# EAGLE design health_companion (EAGLE 9.4.0)
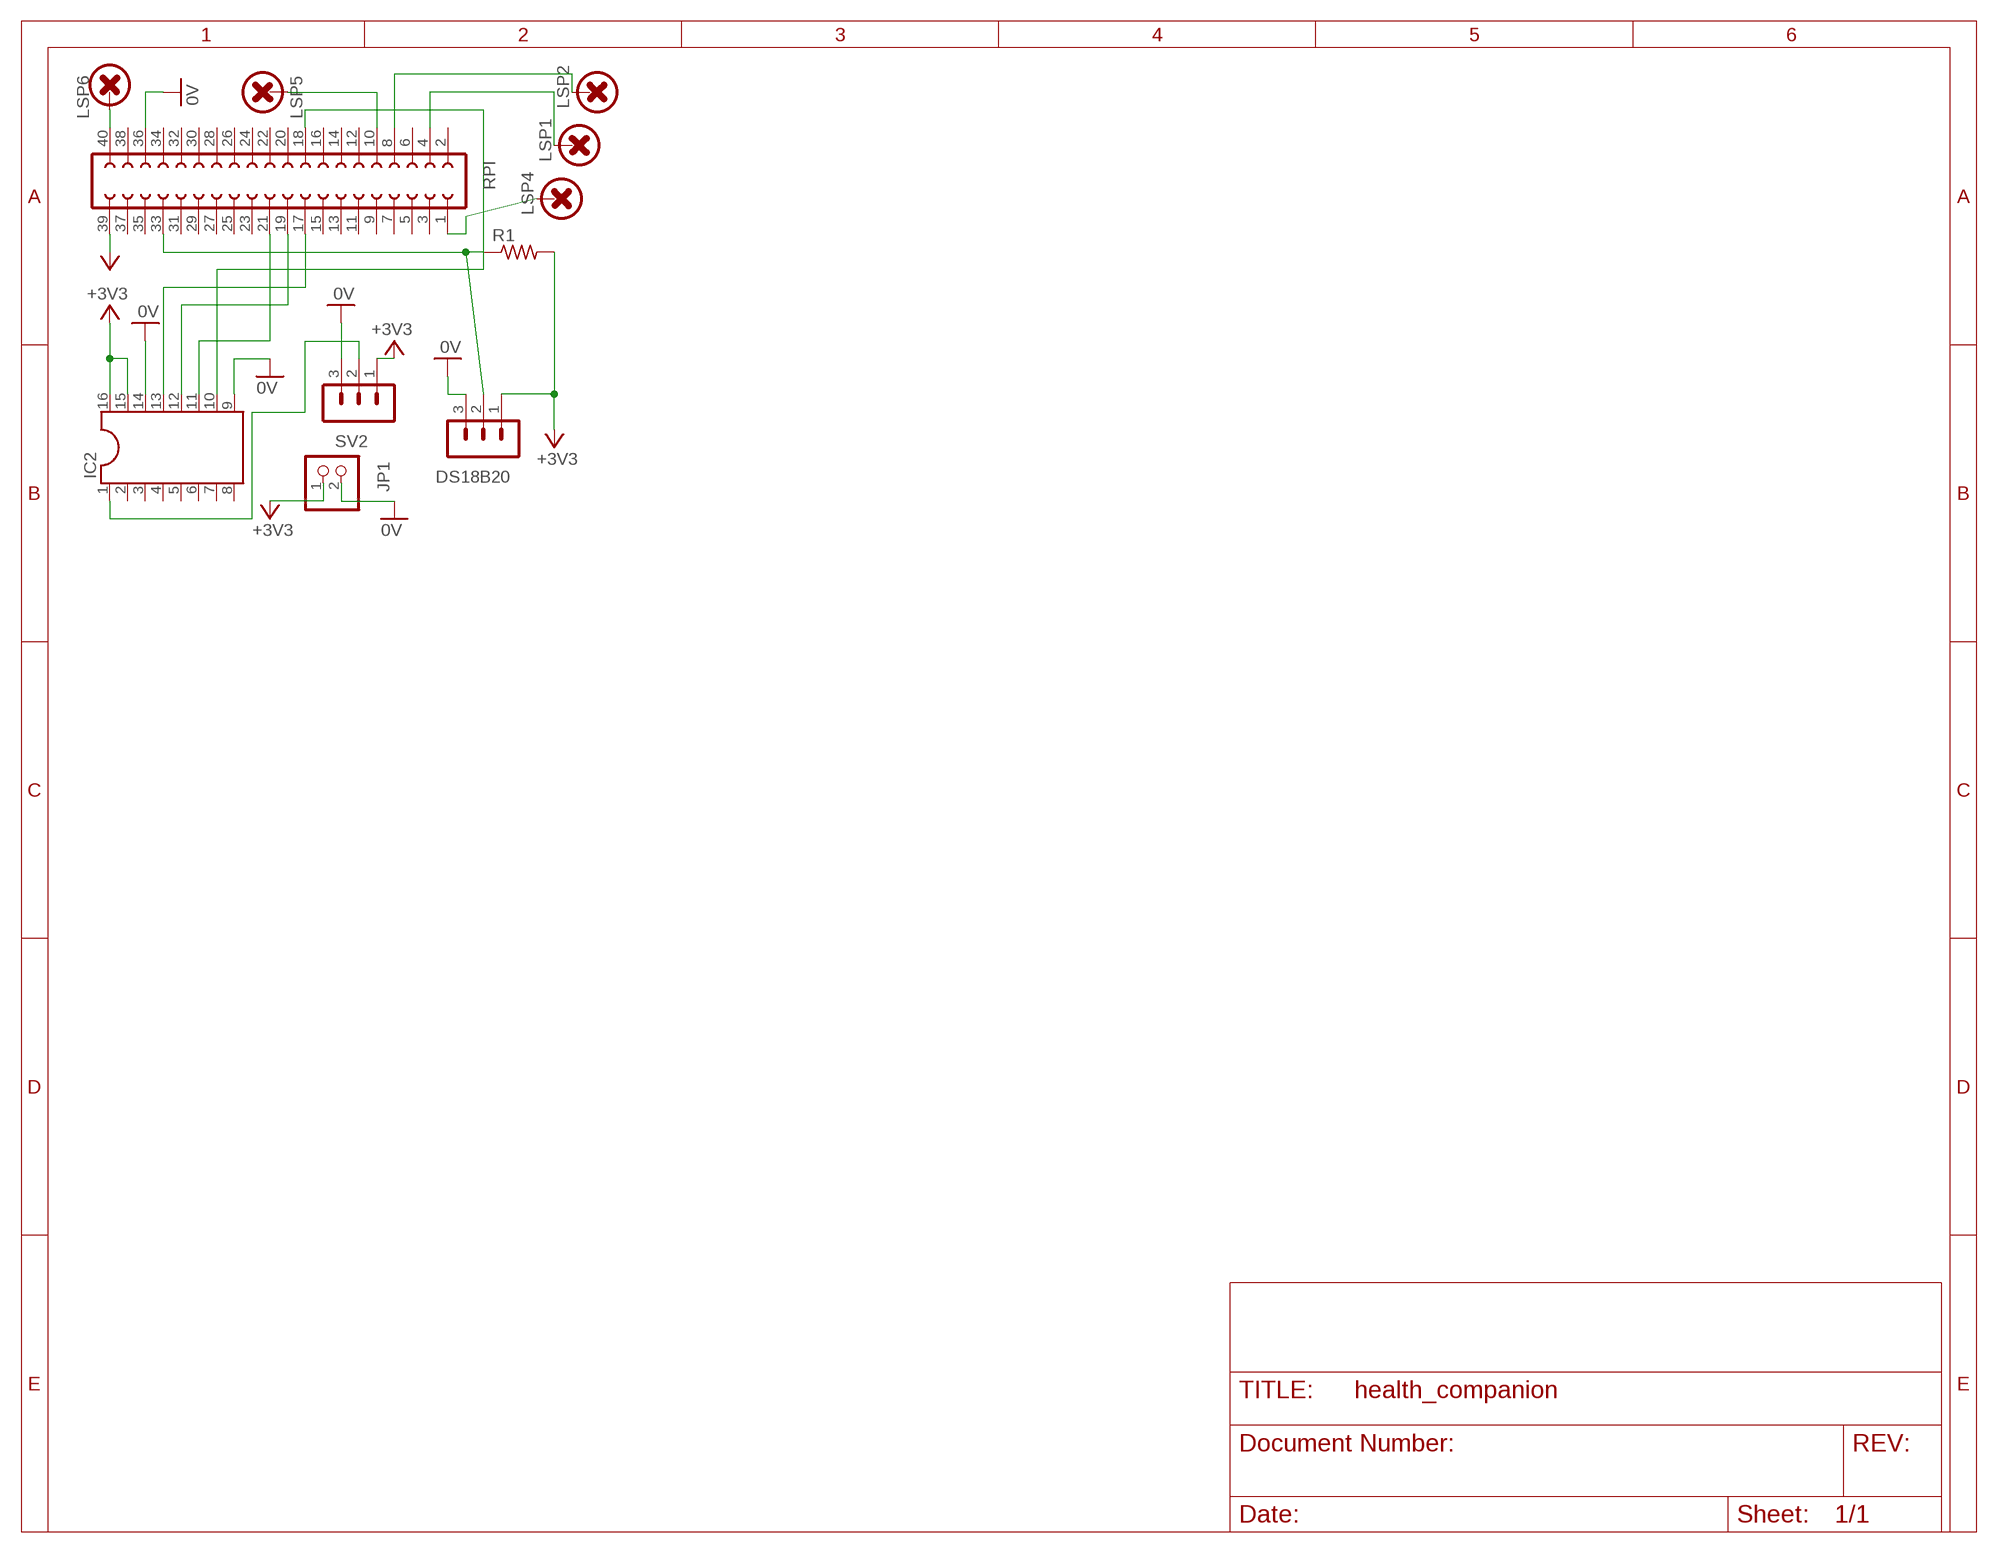
[diagram p0: schematic, sheet 1]

## Parts
DS18B20  MA03-1  [MA03-1]
IC2  DIL16  [DIL16]
JP1  PINHD-1X2  [1X02]
LSP1  LSP11-VAR12.8MM  [LSP11]
LSP2  LSP11-VAR12.8MM  [LSP11]
LSP4  LSP11-VAR12.8MM  [LSP11]
LSP5  LSP11-VAR12.8MM  [LSP11]
LSP6  LSP11-VAR12.8MM  [LSP11]
R1  R-US_0204/5  [0204/5]
RPI  FE20-2  [FE20-2]
SV2  MA03-1  [MA03-1]

## Nets
0V: DS18B20.3 IC2.9 IC2.14 JP1.2 RPI.36 SV2.3
+3V3: DS18B20.1 IC2.15 IC2.16 JP1.1 R1.2 RPI.39 SV2.1
N$1: IC2.10 RPI.18
N$2: DS18B20.2 R1.1 RPI.33
N$3: IC2.13 RPI.17
N$4: IC2.12 RPI.19
N$5: IC2.11 RPI.21
N$6: IC2.1 SV2.2
N$7: LSP2.MP RPI.8
N$8: LSP1.MP RPI.4
N$9: LSP6.MP RPI.40
N$10: LSP4.MP RPI.1
N$11: LSP5.MP RPI.10
Unconnected: IC2.2 IC2.3 IC2.4 IC2.5 IC2.6 IC2.7 IC2.8 RPI.2 RPI.3 RPI.5 RPI.6 RPI.7 RPI.9 RPI.11 RPI.12 RPI.13 RPI.14 RPI.15 RPI.16 RPI.20 RPI.22 RPI.23 RPI.24 RPI.25 RPI.26 RPI.27 RPI.28 RPI.29 RPI.30 RPI.31 RPI.32 RPI.34 RPI.35 RPI.37 RPI.38

## Library data of the parts
DS18B20 SV2 = con-lstb:MA03-1: PIN HEADER; OC_FARNELL: unknown; OC_NEWARK: unknown
IC2 = ic-package:DIL16: Dual In Line / Socket
JP1 = pinhead:PINHD-1X2: PIN HEADER
LSP1 LSP2 LSP4-LSP6 = solpadmm2.8:LSP11-VAR1: SOLDER PAD drill 2.8 mm
R1 = resistor:R-US_: RESISTOR, American symbol
RPI = con-lsta:FE20-2: FEMALE HEADER; OC_FARNELL: unknown; OC_NEWARK: unknown

## Net classes
0 default: width 0.064 mm, drill 0.064 mm

## Board
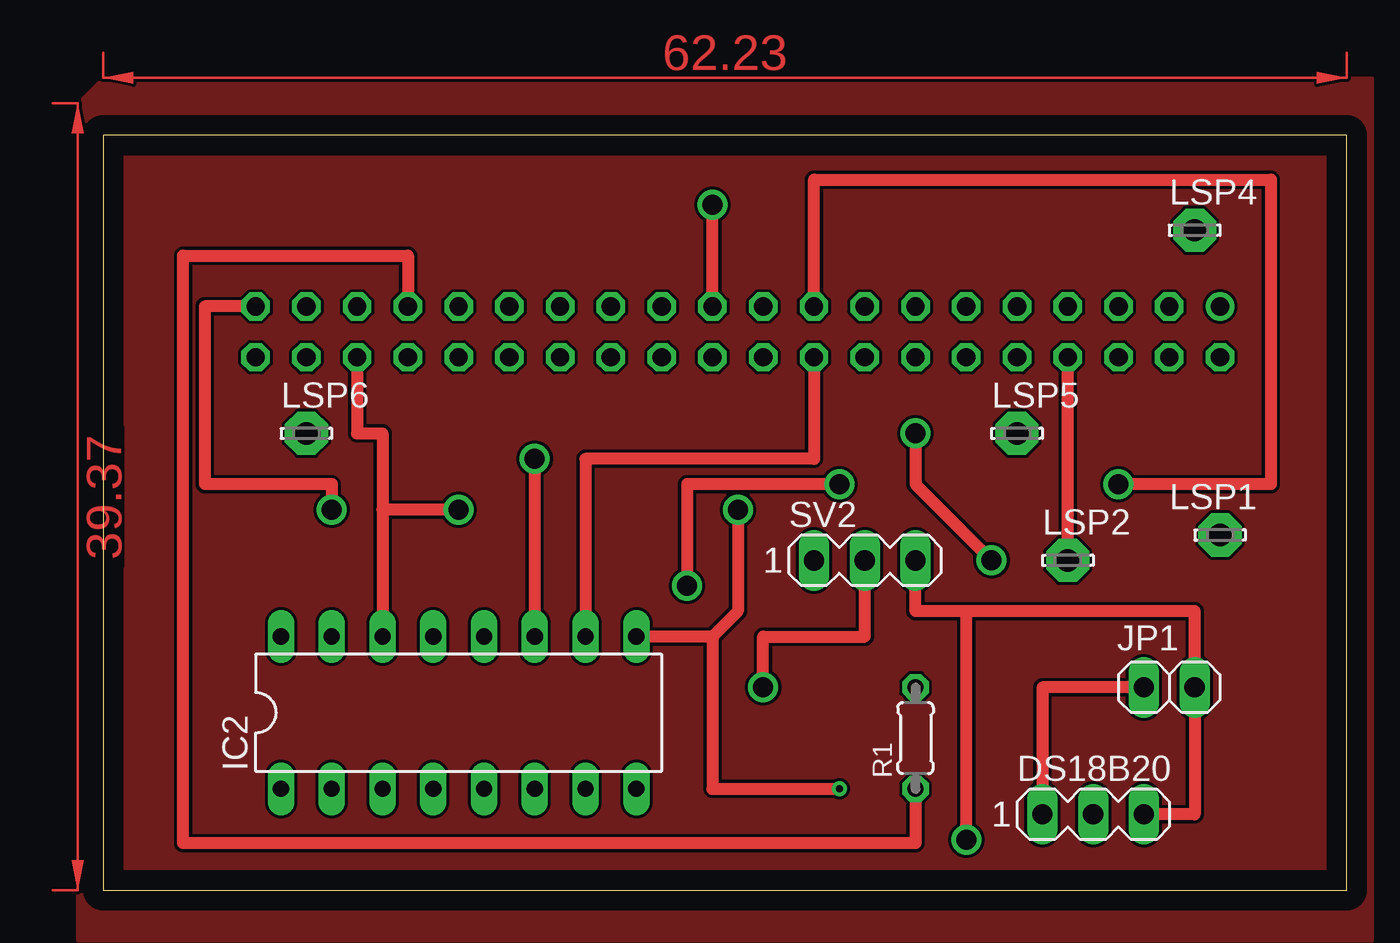
[diagram p1: board, top side]
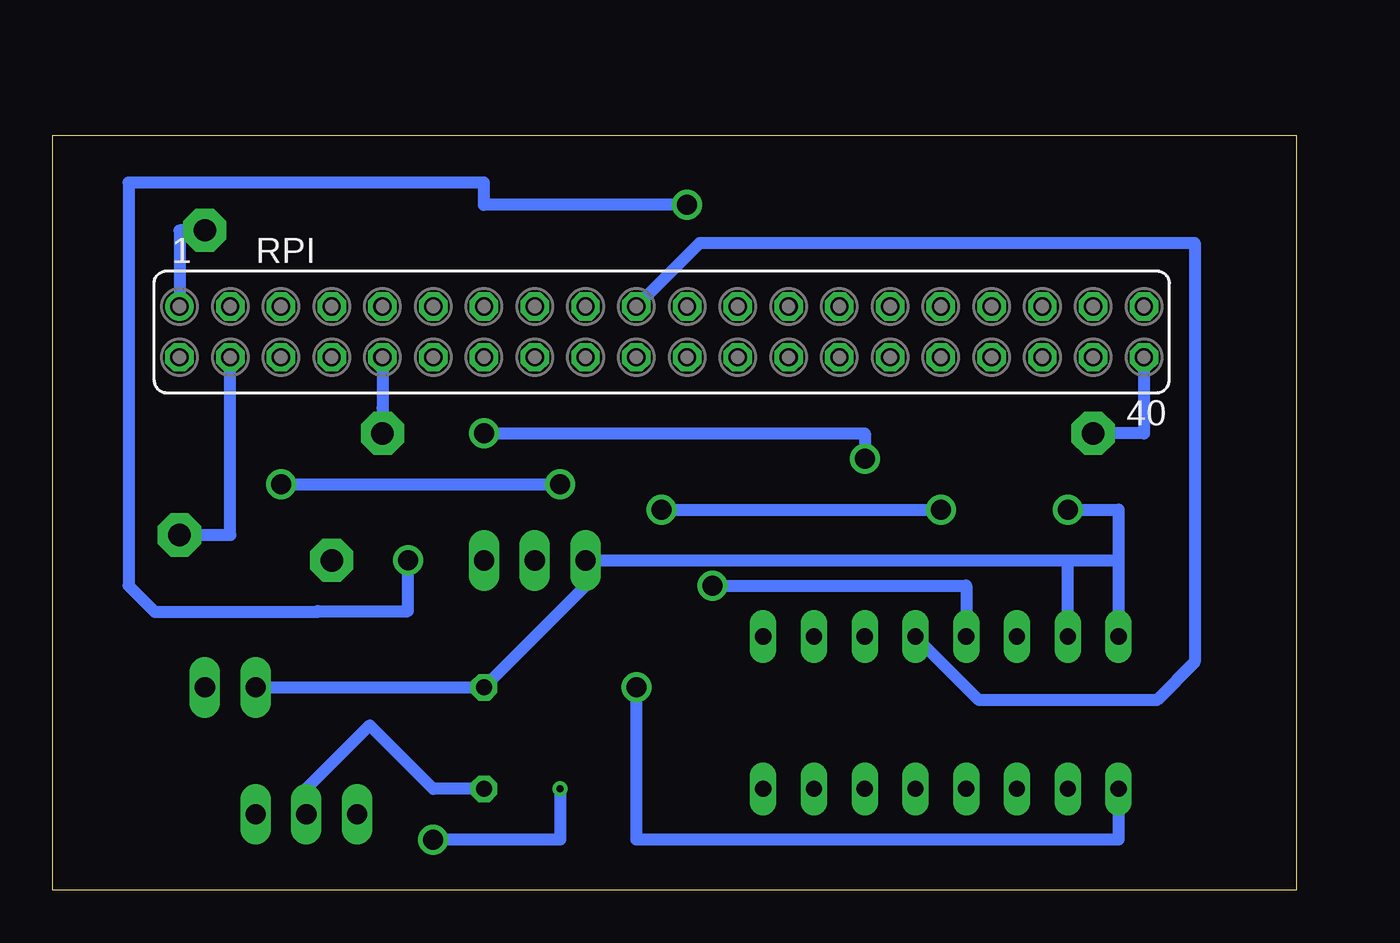
[diagram p2: board, bottom side, seen from below]

Size 62.21 x 37.77 mm. Coordinates in mm from the lower left corner, seen from the top.
Outline: 0,0 62.21,0 62.21,37.77 0,37.77 0,0
Copper layers (1*16): Top 0.035mm / dielectric 1.5mm / Bottom 0.035mm
Design rules "default": minimum track width 6mil, minimum drill 0.35mm, track to track 6mil, track to pad 6mil, pad to pad 6mil, via to via 6mil, smd to smd 6mil, copper to edge 40mil, drill to drill 6mil, minimum pad ring 10mil, minimum via ring 8mil, stop-mask expansion 4mil, vias tented up to drill 0mil, thermal gap 10mil

### Footprints (pad centres in the part's own frame; a part is rotated, then mirrored left to right if it is on the bottom)
MA03-1 = drill 1.016 long: 1 -2.54,0; 2 0,0; 3 2.54,0
DIL16 = drill 0.813 long: 1 -8.89,-3.81; 2 -6.35,-3.81; 3 -3.81,-3.81; 4 -1.27,-3.81; 5 1.27,-3.81; 6 3.81,-3.81; 7 6.35,-3.81; 8 8.89,-3.81; 9 8.89,3.81; 10 6.35,3.81; 11 3.81,3.81; 12 1.27,3.81; 13 -1.27,3.81; 14 -3.81,3.81; 15 -6.35,3.81; 16 -8.89,3.81
1X02 = drill 1.016 long: 1 -1.27,0; 2 1.27,0
LSP11 = drill 1.118 pad 2.159 octagon: MP 0,0
0204/5 = drill 0.813 octagon: 1 -2.54,0; 2 2.54,0
FE20-2 = drill 0.914: 1 -24.13,1.27 | drill 0.914 octagon: 2 -24.13,-1.27; 3 -21.59,1.27; 4 -21.59,-1.27; 5 -19.05,1.27; 6 -19.05,-1.27; 7 -16.51,1.27; 8 -16.51,-1.27; 9 -13.97,1.27; 10 -13.97,-1.27; 11 -11.43,1.27; 12 -11.43,-1.27; 13 -8.89,1.27; 14 -8.89,-1.27; 15 -6.35,1.27; 16 -6.35,-1.27; 17 -3.81,1.27; 18 -3.81,-1.27; 19 -1.27,1.27; 20 -1.27,-1.27; 21 1.27,1.27; 22 1.27,-1.27; 23 3.81,1.27; 24 3.81,-1.27; 25 6.35,1.27; 26 6.35,-1.27; 27 8.89,1.27; 28 8.89,-1.27; 29 11.43,1.27; 30 11.43,-1.27; 31 13.97,1.27; 32 13.97,-1.27; 33 16.51,1.27; 34 16.51,-1.27; 35 19.05,1.27; 36 19.05,-1.27; 37 21.59,1.27; 38 21.59,-1.27; 39 24.13,1.27; 40 24.13,-1.27

### Placement (x,y rotation side)
DS18B20  49.53,3.81 0 top
IC2  17.78,8.89 0 top
JP1  53.34,10.16 0 top
LSP1  55.88,17.78 0 top
LSP2  48.26,16.51 0 top
LSP4  54.61,33.02 0 top
LSP5  45.72,22.86 0 top
LSP6  10.16,22.86 0 top
R1  40.64,7.62 90 top
RPI  31.75,27.94 0 bottom
SV2  38.1,16.51 0 top

### Tracks (layer width: path | path; a pad name or v marks a point on that pad's centre or on a via)
0V  (via drill 0.35, 1 pad 1.05)
  Top 0.61: RPI.36 12.7,22.86 13.97,22.86 13.97,19.05 | 13.97,19.05 IC2.14 | 43.18,13.97 54.61,13.97 JP1.2 54.61,3.81 DS18B20.3 | 43.18,13.97 40.64,13.97 SV2.3 | v31.75,19.05 31.75,13.97 30.48,12.7 | v17.78,19.05 13.97,19.05 | 30.48,12.7 IC2.9 | 30.48,12.7 30.48,5.08 v36.83,5.08 | v43.18,2.54 43.18,13.97
  Bottom 0.61: v31.75,19.05 v17.78,19.05 | v36.83,5.08 36.83,2.54 v43.18,2.54
+3V3  (via drill 1 pad 1.05)
  Top 0.61: DS18B20.1 46.99,10.16 JP1.1 | RPI.39 5.08,29.21 5.08,20.32 11.43,20.32 v11.43,19.05
  Bottom 0.61: 8.89,16.51 8.89,19.05 v11.43,19.05 | 8.89,16.51 IC2.16 | JP1.1 R1.2 35.56,15.24 SV2.1 11.43,16.51 | 11.43,16.51 8.89,16.51 | IC2.15 11.43,16.51
GND
  pour Top: 0,40.64 63.5,40.64 63.5,-2.54 -1.27,-2.54 -1.27,39.37
N$1
  Top 0.61: RPI.18 35.56,21.59 24.13,21.59 IC2.10
N$2
  Top 0.61: R1.1 40.64,2.36 3.99,2.36 3.99,31.75 15.24,31.75 RPI.33
  Bottom 0.61: DS18B20.2 49.53,5.08 46.35,8.26 43.18,5.08 R1.1
N$3  (via drill 1 pad 1.05)
  Top 0.61: RPI.17 35.56,35.56 58.42,35.56 58.42,20.32 v50.8,20.32 | v29.21,15.24 29.21,20.32 v36.83,20.32
  Bottom 0.61: v50.8,20.32 v36.83,20.32 | v29.21,15.24 16.51,15.24 IC2.13
N$4
  Bottom 0.61: IC2.12 15.88,9.53 6.99,9.53 5.08,11.43 5.08,32.38 29.84,32.38 RPI.19
N$5  (via drill 1 pad 1.05)
  Top 0.61: RPI.21 v30.48,34.29 | v40.64,22.86 40.64,20.32 v44.45,16.51 | v21.59,21.59 IC2.11
  Bottom 0.152: 48.99,13.93 48.95,13.97
  Bottom 0.61: v30.48,34.29 40.64,34.29 40.64,35.41 58.42,35.41 58.42,15.24 57.11,13.93 48.99,13.93 | 48.95,13.97 44.45,13.97 v44.45,16.51 | v40.64,22.86 21.59,22.86 v21.59,21.59
N$6  (via drill 1 pad 1.05)
  Top 0.61: v33.02,10.16 33.02,12.7 38.1,12.7 SV2.2
  Bottom 0.61: IC2.1 8.89,2.54 33.02,2.54 v33.02,10.16
N$7
  Top 0.61: LSP2.MP RPI.8
N$8
  Bottom 0.61: RPI.4 53.34,17.78 LSP1.MP
N$9
  Bottom 0.61: RPI.40 7.62,22.86 LSP6.MP
N$10
  Bottom 0.61: RPI.1 55.88,33.02 LSP4.MP
N$11
  Bottom 0.61: RPI.10 45.72,24.13 LSP5.MP
(copper drawn outside any net)
  shapes: Top area x2